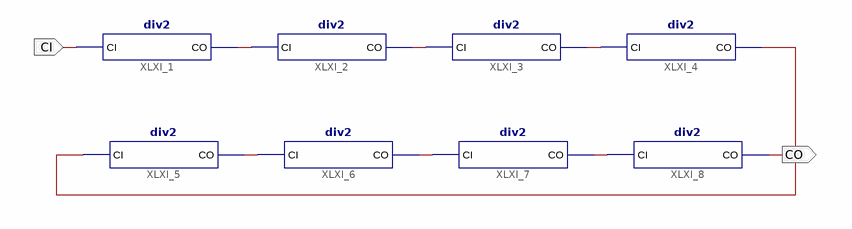
[diagram p0: schematic sheet 1]
// Xilinx ISE schematic div8.sch (spartan6) as structural Verilog: 8 symbols, 2 ports
module div8 (
  input  CI,
  output CO
);

  wire XLXN_1, XLXN_2, XLXN_3, XLXN_4, XLXN_5, XLXN_6, XLXN_10;

  div2 XLXI_1 (.CI(CI), .CO(XLXN_1));
  div2 XLXI_2 (.CI(XLXN_1), .CO(XLXN_2));
  div2 XLXI_3 (.CI(XLXN_2), .CO(XLXN_3));
  div2 XLXI_4 (.CI(XLXN_3), .CO(XLXN_10));
  div2 XLXI_5 (.CI(XLXN_10), .CO(XLXN_4));
  div2 XLXI_6 (.CI(XLXN_4), .CO(XLXN_5));
  div2 XLXI_7 (.CI(XLXN_5), .CO(XLXN_6));
  div2 XLXI_8 (.CI(XLXN_6), .CO(CO));
endmodule
